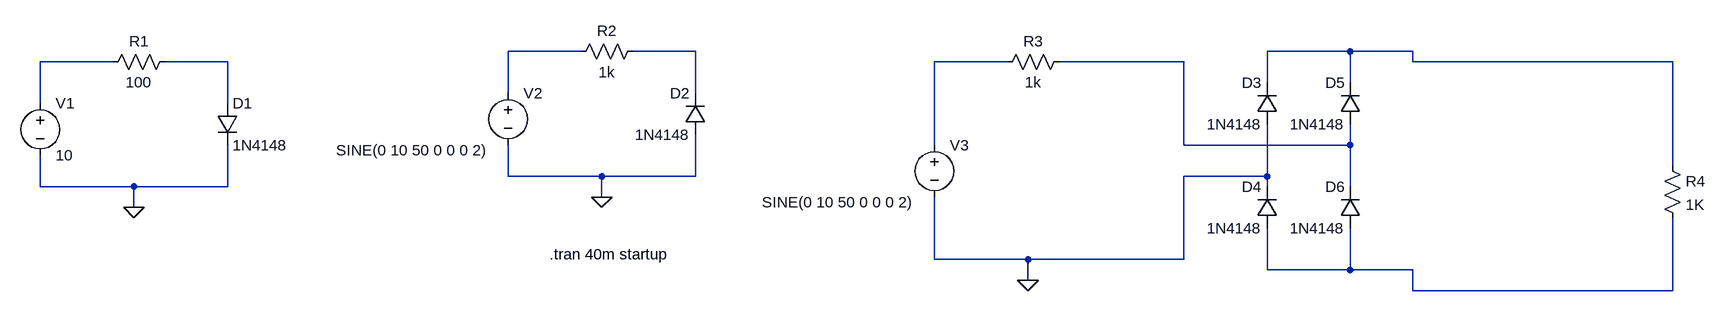
[diagram p0: schematic Diode.asc]
Diode.asc, the LTspice schematic file:
Version 4
SHEET 1 2248 680
WIRE 512 80 400 80
WIRE 688 80 592 80
WIRE 1696 80 1568 80
WIRE 1792 80 1696 80
WIRE -208 96 -320 96
WIRE -32 96 -128 96
WIRE 1168 96 1056 96
WIRE 1440 96 1248 96
WIRE 1792 96 1792 80
WIRE 2192 96 1792 96
WIRE 1568 128 1568 80
WIRE 1696 128 1696 80
WIRE 400 144 400 80
WIRE 688 144 688 80
WIRE -320 160 -320 96
WIRE -32 160 -32 96
WIRE 1056 224 1056 96
WIRE 1440 224 1440 96
WIRE 1696 224 1696 192
WIRE 1696 224 1440 224
WIRE 2192 256 2192 96
WIRE 400 272 400 224
WIRE 544 272 400 272
WIRE 688 272 688 208
WIRE 688 272 544 272
WIRE 1568 272 1568 192
WIRE 1568 272 1440 272
WIRE -320 288 -320 240
WIRE -176 288 -320 288
WIRE -32 288 -32 224
WIRE -32 288 -176 288
WIRE 1568 288 1568 272
WIRE 1696 288 1696 224
WIRE 544 304 544 272
WIRE -176 320 -176 288
WIRE 1056 400 1056 304
WIRE 1200 400 1056 400
WIRE 1440 400 1440 272
WIRE 1440 400 1200 400
WIRE 1568 416 1568 352
WIRE 1696 416 1696 352
WIRE 1696 416 1568 416
WIRE 1792 416 1696 416
WIRE 1200 432 1200 400
WIRE 1792 448 1792 416
WIRE 2192 448 2192 336
WIRE 2192 448 1792 448
FLAG -176 320 0
FLAG 544 304 0
FLAG 1200 432 0
SYMBOL voltage -320 144 R0
WINDOW 123 0 0 Left 0
WINDOW 39 0 0 Left 0
SYMATTR InstName V1
SYMATTR Value 10
SYMBOL res -112 80 R90
WINDOW 0 0 56 VBottom 2
WINDOW 3 32 56 VTop 2
SYMATTR InstName R1
SYMATTR Value 100
SYMBOL voltage 400 128 R0
WINDOW 3 -265 104 Left 2
WINDOW 123 0 0 Left 0
WINDOW 39 0 0 Left 0
SYMATTR Value SINE(0 10 50 0 0 0 2)
SYMATTR InstName V2
SYMBOL res 608 64 R90
WINDOW 0 0 56 VBottom 2
WINDOW 3 32 56 VTop 2
SYMATTR InstName R2
SYMATTR Value 1k
SYMBOL diode -48 160 R0
SYMATTR InstName D1
SYMATTR Value 1N4148
SYMBOL diode 704 208 R180
WINDOW 0 24 64 Left 2
WINDOW 3 24 0 Left 2
SYMATTR InstName D2
SYMATTR Value 1N4148
SYMBOL voltage 1056 208 R0
WINDOW 3 -265 104 Left 2
WINDOW 123 0 0 Left 0
WINDOW 39 0 0 Left 0
SYMATTR Value SINE(0 10 50 0 0 0 2)
SYMATTR InstName V3
SYMBOL res 1264 80 R90
WINDOW 0 0 56 VBottom 2
WINDOW 3 32 56 VTop 2
SYMATTR InstName R3
SYMATTR Value 1k
SYMBOL res 2176 240 R0
SYMATTR InstName R4
SYMATTR Value 1K
SYMBOL diode 1584 192 R180
WINDOW 0 24 64 Left 2
WINDOW 3 24 0 Left 2
SYMATTR InstName D3
SYMATTR Value 1N4148
SYMBOL diode 1584 352 R180
WINDOW 0 24 64 Left 2
WINDOW 3 24 0 Left 2
SYMATTR InstName D4
SYMATTR Value 1N4148
SYMBOL diode 1712 192 R180
WINDOW 0 24 64 Left 2
WINDOW 3 24 0 Left 2
SYMATTR InstName D5
SYMATTR Value 1N4148
SYMBOL diode 1712 352 R180
WINDOW 0 24 64 Left 2
WINDOW 3 24 0 Left 2
SYMATTR InstName D6
SYMATTR Value 1N4148
TEXT 464 392 Left 2 !.tran 40m startup

The netlist it stands for:
* Diode.asc
V1 N004 0 10
R1 N005 N004 100
V2 N001 0 SINE(0 10 50 0 0 0 2)
R2 N002 N001 1k
D1 N005 0 1N4148
D2 0 N002 1N4148
V3 N006 0 SINE(0 10 50 0 0 0 2)
R3 N007 N006 1k
R4 N003 N008 1K
D3 0 N003 1N4148
D4 N008 0 1N4148
D5 N007 N003 1N4148
D6 N008 N007 1N4148
.model D D
.lib standard.dio
.tran 40m startup
.backanno
.end